# EAGLE design pqc-rev2 (EAGLE 9.0.1)
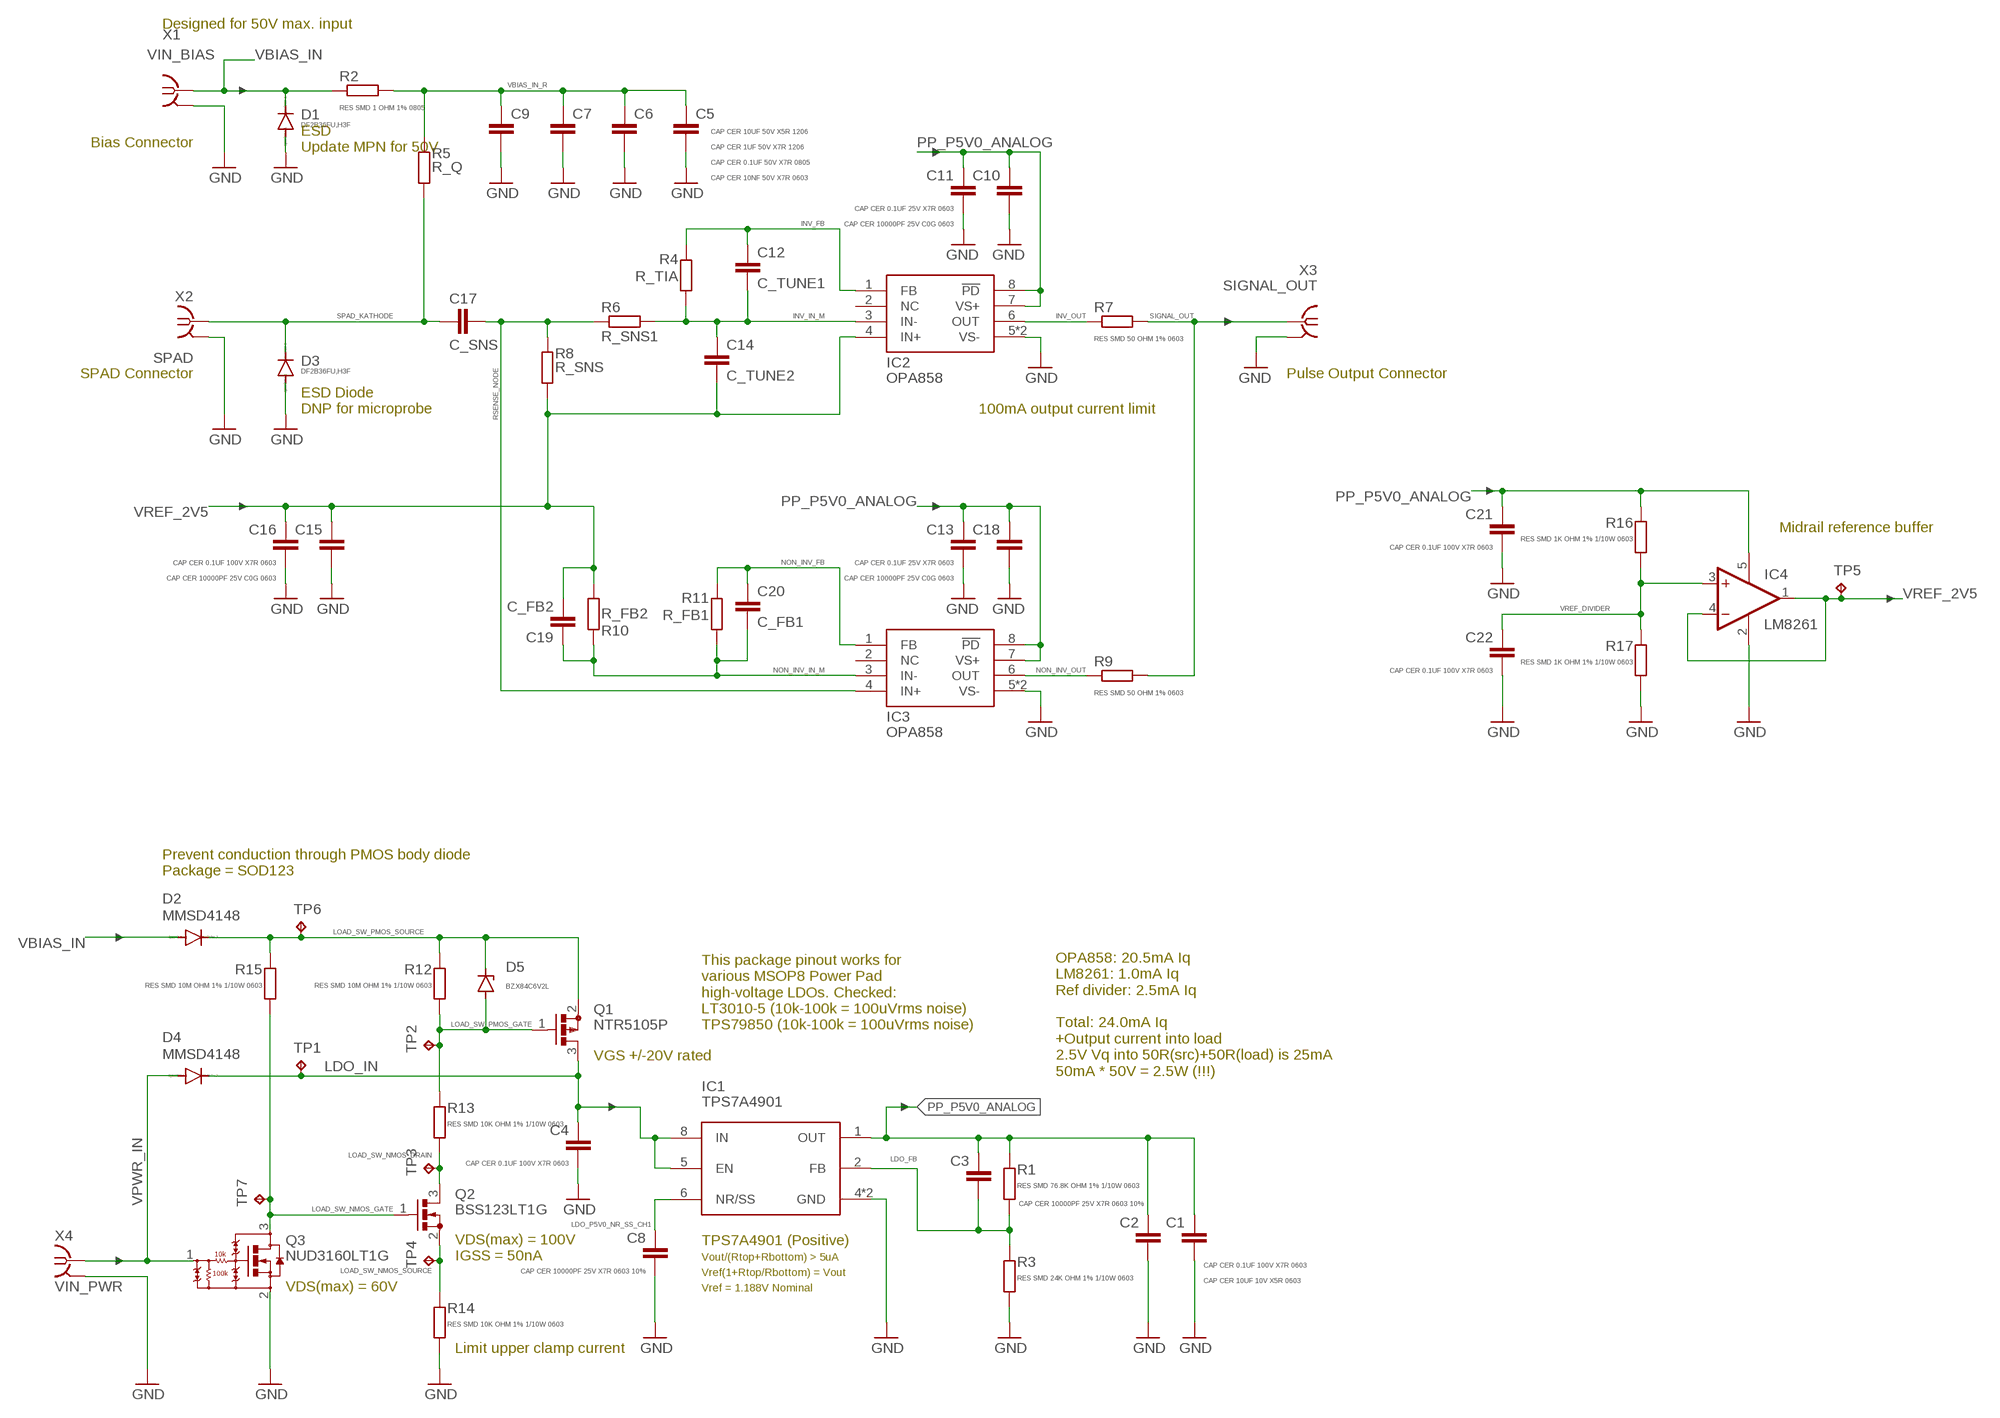
[diagram p0: schematic, sheet 1]

## Parts
C1  CAP CER 10UF 10V X5R 0603  C-EUC0603  [C0603]
C2  CAP CER 0.1UF 100V X7R 0603  C-EUC0603  [C0603]
C3  CAP CER 10000PF 25V X7R 0603 10%  C-EUC0603  [C0603]
C4  CAP CER 0.1UF 100V X7R 0603  C-EUC0603  [C0603]
C5  CAP CER 10UF 50V X5R 1206  C-EUC1206  [C1206]
C6  CAP CER 1UF 50V X7R 1206  C-EUC1206  [C1206]
C7  CAP CER 0.1UF 50V X7R 0805  C-EUC0805  [C0805]
C8  CAP CER 10000PF 25V X7R 0603 10%  C-EUC0603  [C0603]
C9  CAP CER 10NF 50V X7R 0603  C-EUC0603  [C0603]
C10  CAP CER 10000PF 25V C0G 0603  C-EUC0603  [C0603]
C11  CAP CER 0.1UF 25V X7R 0603  C-EUC0603  [C0603]
C12  C_TUNE1  C-EUC0402  [C0402]
C13  CAP CER 0.1UF 25V X7R 0603  C-EUC0603  [C0603]
C14  C_TUNE2  C-EUC0402  [C0402]
C15  CAP CER 10000PF 25V C0G 0603  C-EUC0603  [C0603]
C16  CAP CER 0.1UF 100V X7R 0603  C-EUC0603  [C0603]
C17  C_SNS  C-EUC0603  [C0603]
C18  CAP CER 10000PF 25V C0G 0603  C-EUC0603  [C0603]
C19  C_FB2  C-EUC0402  [C0402]
C20  C_FB1  C-EUC0402  [C0402]
C21  CAP CER 0.1UF 100V X7R 0603  C-EUC0603  [C0603]
C22  CAP CER 0.1UF 100V X7R 0603  C-EUC0603  [C0603]
D1  DF2B36FU,H3F  DIODE-SOD323-W  [SOD323-W]
D2  MMSD4148  DIODE-SOD123  [SOD123]
D3  DF2B36FU,H3F  DIODE-SOD323-W  [SOD323-W]
D4  MMSD4148  DIODE-SOD123  [SOD123]
D5  BZX84C6V2L  ZENER-DIODESOT23  [SOT23]
IC1  TPS7A4901  TPS7A  [MSOP-8_POWER_PAD]
IC2  OPA858  [WSON8]
IC3  OPA858  [WSON8]
IC4  LM8261  [SOT23-5]
Q1  NTR5105P  PMOS_GENERIC_SOT23-3  [SOT23C]
Q2  BSS123LT1G  NMOS_GENERIC  [SOT23C]
Q3  NUD3160LT1G  [SOT23C]
R1  RES SMD 76.8K OHM 1% 1/10W 0603  R-EU_R0603  [R0603]
R2  RES SMD 1 OHM 1% 0805  R-EU_R0805  [R0805]
R3  RES SMD 24K OHM 1% 1/10W 0603  R-EU_R0603  [R0603]
R4  R_TIA  R-EU_R0402  [R0402]
R5  R_Q  R-EU_R0805  [R0805]
R6  R_SNS1  R-EU_R0402  [R0402]
R7  RES SMD 50 OHM 1% 0603  R-EU_R0603  [R0603]
R8  R_SNS  R-EU_R0402  [R0402]
R9  RES SMD 50 OHM 1% 0603  R-EU_R0603  [R0603]
R10  R_FB2  R-EU_R0402  [R0402]
R11  R_FB1  R-EU_R0402  [R0402]
R12  RES SMD 10M OHM 1% 1/10W 0603  R-EU_R0603  [R0603]
R13  RES SMD 10K OHM 1% 1/10W 0603  R-EU_R0603  [R0603]
R14  RES SMD 10K OHM 1% 1/10W 0603  R-EU_R0603  [R0603]
R15  RES SMD 10M OHM 1% 1/10W 0603  R-EU_R0603  [R0603]
R16  RES SMD 1K OHM 1% 1/10W 0603  R-EU_R0603  [R0603]
R17  RES SMD 1K OHM 1% 1/10W 0603  R-EU_R0603  [R0603]
TP1  TPTP10R  [TP10R]
TP2  TPTP10R  [TP10R]
TP3  TPTP10R  [TP10R]
TP4  TPTP10R  [TP10R]
TP5  TPTP10R  [TP10R]
TP6  TPTP10R  [TP10R]
TP7  TPB1,27  [B1,27]
X1  VIN_BIAS  COAX  [MMCX-J-P-X-ST-EM1-MKT]
X2  SPAD  SMA-142-0701-881/886  [J502-ND-142-0701-881/886]
X3  SIGNAL_OUT  COAX  [MMCX-J-P-X-ST-EM1-MKT]
X4  VIN_PWR  COAX  [MMCX-J-P-X-ST-EM1-MKT]

## Nets
GND: C1.2 C2.2 C4.2 C5.2 C6.2 C7.2 C8.2 C9.2 C10.2 C11.2 C13.2 C15.2 C16.2 C18.2 C21.2 C22.2 D1.A D3.A IC1.4(GND) IC1.PAD(GND) IC2.5(VS-) IC2.PAD(VS-) IC3.5(VS-) IC3.PAD(VS-) IC4.2(V-) Q3.2(S) R3.2 R14.1 R17.1 X1.2@1(GND) X2.G@1(GND) X3.2@1(GND) X4.2@1(GND)
INV_FB: C12.1 IC2.1(FB) R4.1
INV_IN_M: C12.2 C14.1 IC2.3(IN-) R4.2 R6.1
INV_OUT: IC2.6(OUT) R7.2
LDO_FB: C3.2 IC1.2(FB) R1.1 R3.1
LDO_IN: C4.1 D4.C IC1.5(EN) IC1.8(IN) Q1.3(D) TP1.TP
LDO_P5V0_NR_SS_CH1: C8.1 IC1.6(NR/SS)
LOAD_SW_NMOS_DRAIN: Q2.3(D) R13.1 TP3.TP
LOAD_SW_NMOS_GATE: Q2.1(G) Q3.3(D) R15.1 TP7.TP
LOAD_SW_NMOS_SOURCE: Q2.2(S) R14.2 TP4.TP
LOAD_SW_PMOS_GATE: D5.1(A) Q1.1(G) R12.1 R13.2 TP2.TP
LOAD_SW_PMOS_SOURCE: D2.C D5.3(C) Q1.2(S) R12.2 R15.2 TP6.TP
NON_INV_FB: C20.1 IC3.1(FB) R11.1
NON_INV_IN_M: C19.1 C20.2 IC3.3(IN-) R10.1 R11.2
NON_INV_OUT: IC3.6(OUT) R9.2
PP_P5V0_ANALOG: C1.1 C2.1 C3.1 C10.1 C11.1 C13.1 C18.1 C21.1 IC1.1(OUT) IC2.7(VS+) IC2.8(!PD) IC3.7(VS+) IC3.8(!PD) IC4.5(V+) R1.2 R16.2
RSENSE_NODE: C17.2 IC3.4(IN+) R6.2 R8.2
SIGNAL_OUT: R7.1 R9.1 X3.1
SPAD_KATHODE: C17.1 D3.C R5.1 X2.1
VBIAS_IN: D1.C D2.A R2.2 X1.1
VBIAS_IN_R: C5.1 C6.1 C7.1 C9.1 R2.1 R5.2
VPWR_IN: D4.A Q3.1(G) X4.1
VREF_2V5: C14.2 C15.1 C16.1 C19.2 IC2.4(IN+) IC4.1(OUT) IC4.4(-IN) R8.1 R10.2 TP5.TP
VREF_DIVIDER: C22.1 IC4.3(+IN) R16.1 R17.2
Unconnected: IC2.2(NC) IC3.2(NC)

## Notes on the sheet
- Designed for 50V max. input
- Bias Connector
- ESD
  Update MPN for 50V
- SPAD Connector | Pulse Output Connector
- ESD Diode
  DNP for microprobe
- 100mA output current limit
- Midrail reference buffer
- Prevent conduction through PMOS body diode
  Package = SOD123
- This package pinout works for
  various MSOP8 Power Pad
  high-voltage LDOs. Checked:
  LT3010-5 (10k-100k = 100uVrms noise)
  TPS79850 (10k-100k = 100uVrms noise)
- VGS +/-20V rated
- OPA858: 20.5mA Iq
  LM8261: 1.0mA Iq
  Ref divider: 2.5mA Iq
  
  Total: 24.0mA Iq
  +Output current into load
  2.5V Vq into 50R(src)+50R(load) is 25mA
  50mA * 50V = 2.5W (!!!)
- TPS7A4901 (Positive)
- VDS(max) = 100V
  IGSS = 50nA
- Vout/(Rtop+Rbottom) > 5uA
- Vref(1+Rtop/Rbottom) = Vout
- VDS(max) = 60V | Vref = 1.188V Nominal
- Limit upper clamp current

## Power pins joined to a net without a drawn wire
GND: X1.2@2(GND) X1.2@3(GND) X1.2@4(GND) X2.G@2(GND) X2.G@3(GND) X2.G@4(GND) X3.2@2(GND) X3.2@3(GND) X3.2@4(GND) X4.2@2(GND) X4.2@3(GND) X4.2@4(GND)

## Library data of the parts
C1-C4 C8-C22 = rcl-modified-footprints:C-EU: CAPACITOR, European symbol
C5-C7 = rcl:C-EU: CAPACITOR, European symbol
D1-D4 = diode:DIODE-: DIODE
D5 = diode:ZENER-DIODE: Z-Diode
IC1 = Kramnik's Library:TPS7A*
IC2 IC3 = meng:OPA858
IC4 = meng:LM8261
Q1 = meng:PMOS_GENERIC
Q2 = meng:NMOS_GENERIC
Q3 = meng:NUD3160LT1G
R1 R3 R4 R6-R17 = rcl-modified-footprints:R-EU_: RESISTOR, European symbol
R2 R5 = rcl:R-EU_: RESISTOR, European symbol; SPICEPREFIX: R
TP1-TP7 = testpad:TP: Test pad
X1 X3 X4 = con-samtec:COAX: MMCX STRAIGHT, EDGE MOUNT JACK- 50 OHM Source: http://www.samtec.com/ftppub/cpdf/MMCX-J-P-X-ST-EM1-MKT.pdf; MF: Samtec Inc.; MPN: MMCX-J-P-X-ST-EM1-MKT; OC_FARNELL: unknown; OC_NEWARK: unknown
X2 = meng:SMA-: SMA 50 Ohm End Launch Jack Receptacle - Round Contact Johnson Components Source: www.johnsoncomponents.com .. J502-ND.pdf; MF: JOHNSON COMPONENTS; MPN: 142-0701-881; OC_FARNELL: 1608603; OC_NEWARK: 08B906

## Net classes
1 100OHM_DIFF: width 0.254 mm, clearance 0.254 mm

## Board
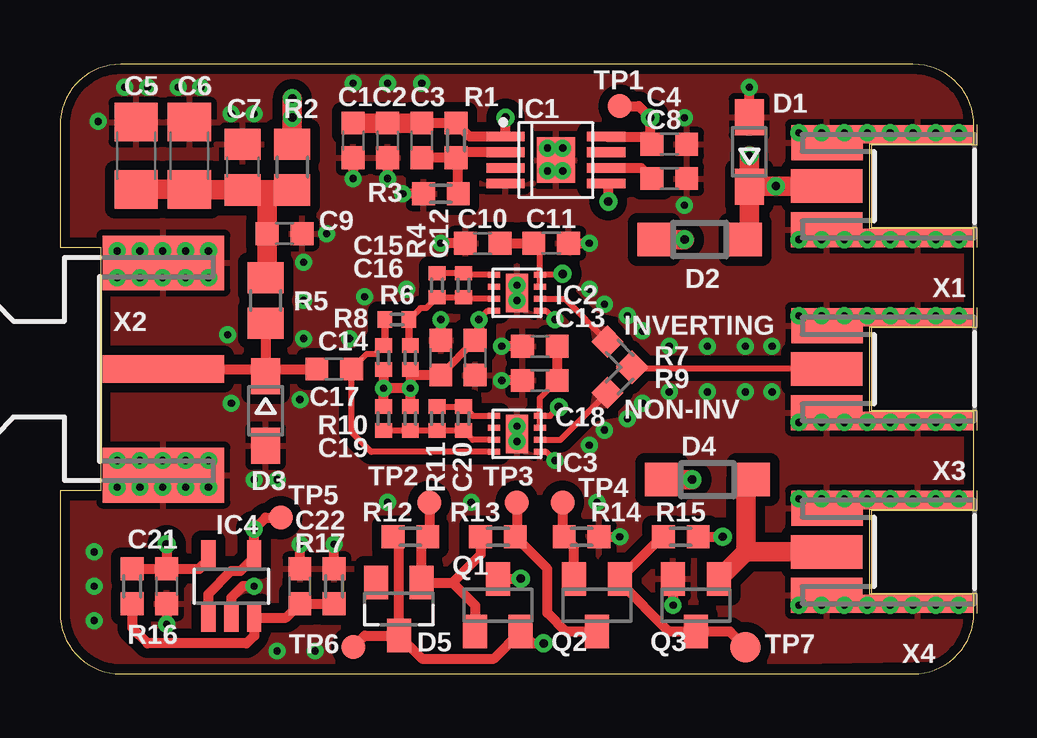
[diagram p1: board, top side]
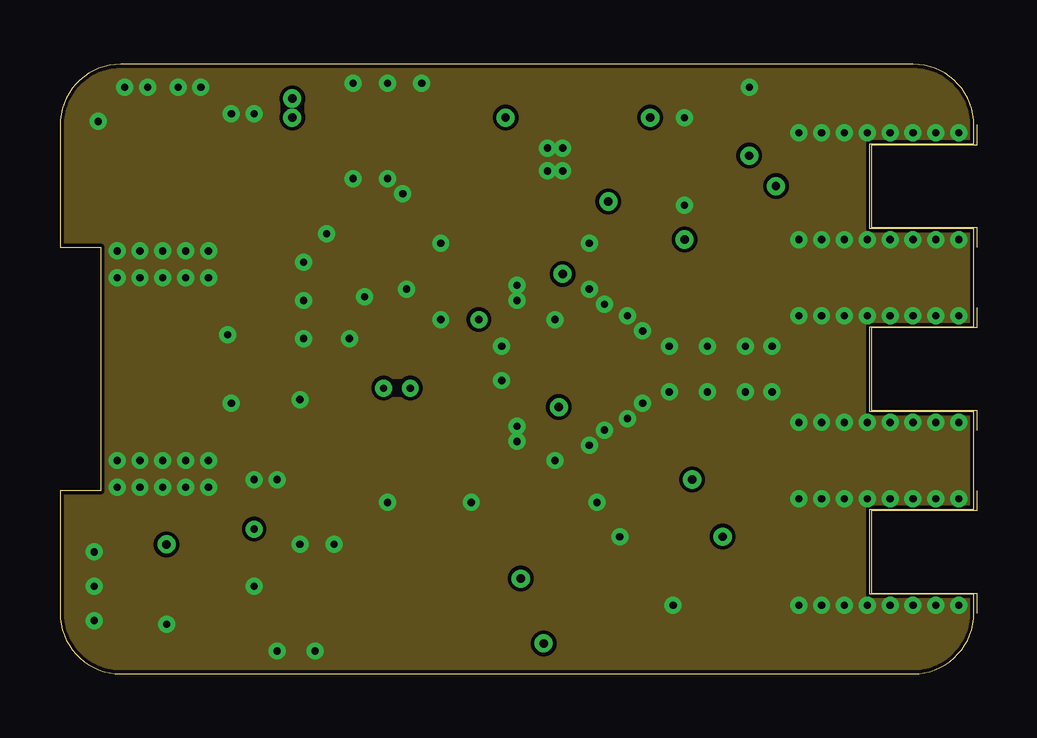
[diagram p2: board, inner layer Route2]
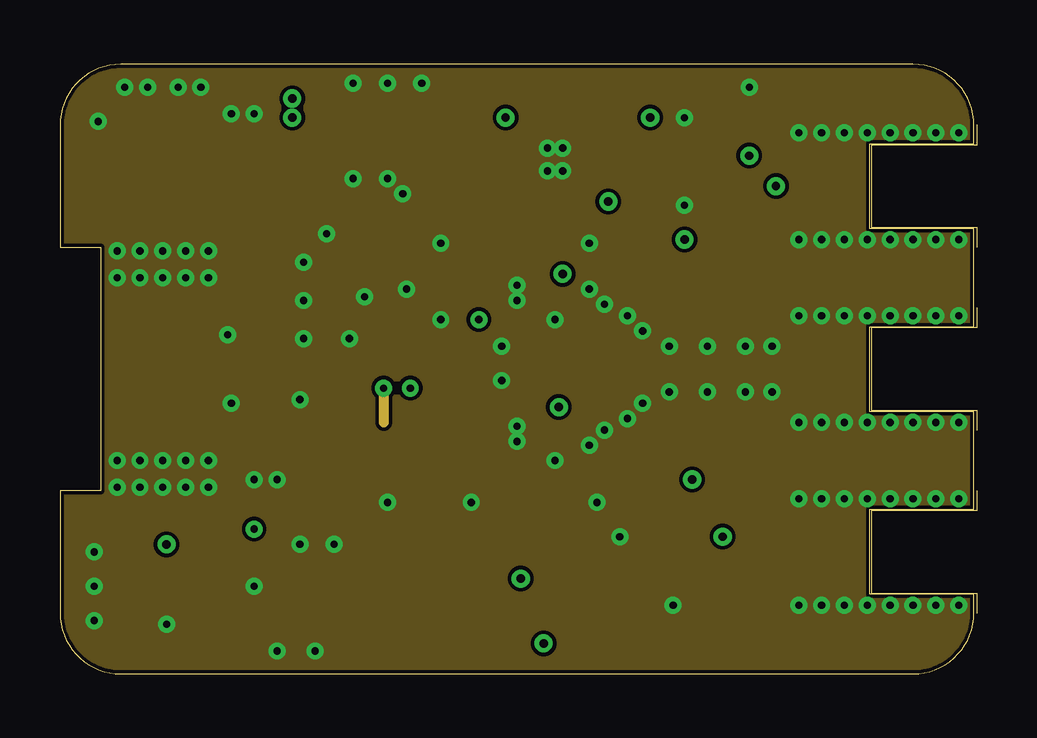
[diagram p3: board, inner layer Route15]
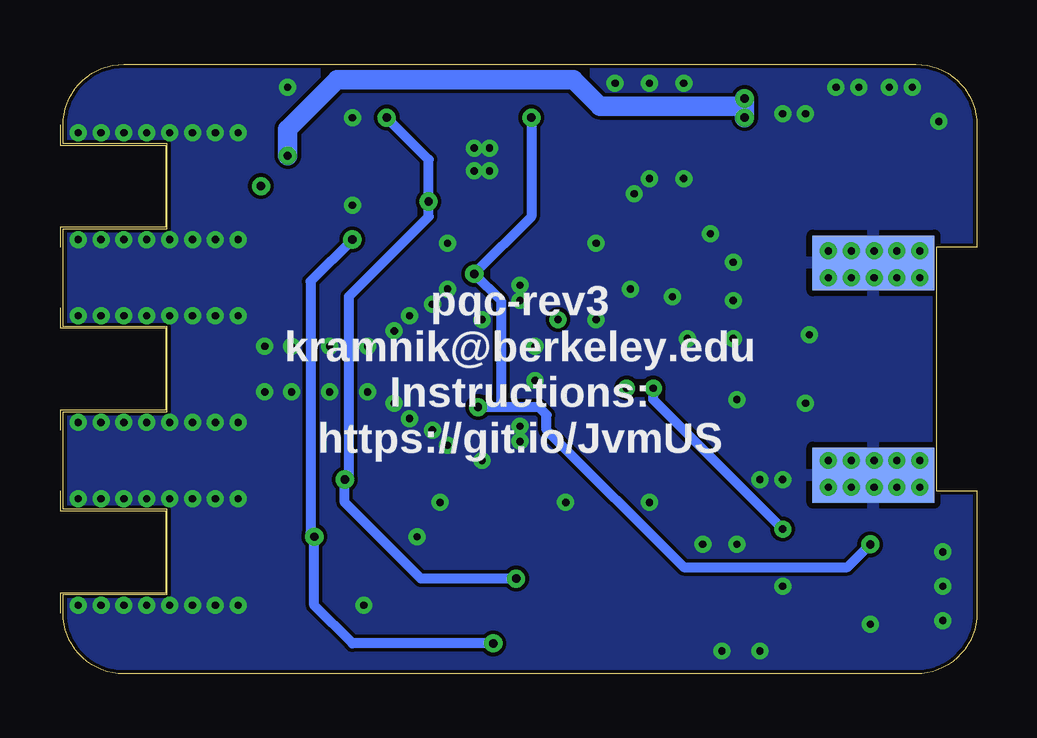
[diagram p4: board, bottom side, seen from below]

Size 38.1 x 25.4 mm. Coordinates in mm from the lower left corner, seen from the top.
Outline: 0,7.62 0,2.54 arc90 2.54,0 35.56,0 arc90 38.1,2.54 38.1,3.31 33.76,3.31 33.76,6.85 38.1,6.85 38.1,10.93 33.76,10.93 33.76,14.47 38.1,14.47 38.1,18.55 33.76,18.55 33.76,22.09 38.1,22.09 38.1,22.86 arc90 35.56,25.4 2.54,25.4 arc90 0,22.86 0,17.78 1.7,17.78 1.7,7.62 0,7.62
Copper layers (1+2*15+16): Top 0.035mm / dielectric 1.5mm / Route2 0.035mm / dielectric 0.15mm / Route15 0.035mm / dielectric 0.2mm / Bottom 0.035mm
Design rules "default *": minimum track width 6mil, minimum drill 0.3mm, track to track 6mil, track to pad 6mil, pad to pad 6mil, via to via 6mil, smd to smd 0mil, copper to edge 6mil, drill to drill 6mil, minimum pad ring 10mil, minimum via ring 8mil, stop-mask expansion 2mil, vias tented up to drill 0.35mm, thermal gap 10mil

### Footprints (pad centres in the part's own frame; a part is rotated, then mirrored left to right if it is on the bottom)
C0603 = smd 0.95 x 0.95: 1 -0.725,0; 2 0.725,0
C1206 = smd 1.6 x 1.8: 1 -1.4,0; 2 1.4,0
C0805 = smd 1.3 x 1.5: 1 -0.95,0; 2 0.95,0
C0402 = smd 0.6 x 0.7: 1 -0.5,0; 2 0.5,0
SOD323-W = smd 1.5 x 1.2: A 1.45,0; C -1.45,0
SOD123 = smd 1.4 x 1.4: A 1.9,0; C -1.9,0
SOT23 = smd 1 x 1.4: 1 -0.95,-1.1; 2 0.95,-1.1; 3 0,1.1
MSOP-8_POWER_PAD = smd 0.4 x 1.6: 1 0,0; 2 0.65,0; 3 1.3,0; 4 1.95,0; 5 1.95,4.2; 6 1.3,4.2; 7 0.65,4.2; 8 0,4.2 | smd 1.89 x 1.57: PAD 0.975,2.1
WSON8 = smd 0.5 x 0.25: 1 -0.95,0.75; 2 -0.95,0.25; 3 -0.95,-0.25; 4 -0.95,-0.75; 5 0.95,-0.75; 6 0.95,-0.25; 7 0.95,0.25; 8 0.95,0.75 | smd 0.9 x 1.6: PAD 0,0
SOT23-5 = smd 0.6 x 1.2: 1 -0.95,-1.306; 2 0,-1.306; 3 0.95,-1.306; 4 0.95,1.306; 5 -0.95,1.306
SOT23C = smd 1 x 1.4: 1 -0.95,-1.1; 2 0.95,-1.1; 3 0,1.1
R0603 = smd 0.95 x 0.95: 1 -0.725,0; 2 0.725,0
R0805 = smd 1.3 x 1.5: 1 -0.95,0; 2 0.95,0
R0402 = smd 0.6 x 0.7: 1 -0.5,0; 2 0.5,0
TP10R = smd 1 x 1: TP 0,0
B1,27 = smd 1.27 x 1.27: TP 0,0
MMCX-J-P-X-ST-EM1-MKT = smd 1.4 x 2.975: 1 0,-6.15 | smd 1.46 x 2.975: 2@1 -1.812,-6.125; 2@2 1.812,-6.138 | smd 0.76 x 4.7: 2@3 -2.163,-2.35; 2@4 2.163,-2.35
J502-ND-142-0701-881/886 = smd 5.08 x 1.143: 1 2.565,0 | smd 5.08 x 2.286: G@1 2.565,4.42; G@2 2.565,-4.42 | smd 5.08 x 2.286 bottom: G@3 2.565,4.42; G@4 2.565,-4.42

### Placement (x,y rotation side)
C1  12.22,22.23 270 top
C2  13.65,22.23 270 top
C3  15.08,22.23 270 top
C4  25.4,22.07 0 top
C5  3.17,21.59 90 top
C6  5.4,21.59 90 top
C7  7.62,21.11 90 top
C8  25.4,20.64 0 top
C9  9.37,18.34 0 top
C10  17.62,17.94 180 top
C11  20.48,17.94 0 top
C12  16.83,16.19 270 top
C13  20,13.65 180 top
C14  14.61,13.18 270 top
C15  15.88,13.18 90 top
C16  17.3,13.18 270 top
C17  11.43,12.7 0 top
C18  20,12.22 180 top
C19  14.61,10.64 90 top
C20  16.83,10.64 270 top
C21  4.45,3.65 270 top
C22  10,3.65 90 top
D1  28.73,21.75 90 top
D2  26.67,18.1 0 top
D3  8.57,10.95 270 top
D4  26.99,8.1 0 top
D5  14.13,2.7 180 top
IC1  18.57,22.38 270 top
IC2  19.05,15.88 0 top
IC3  19.05,10 0 top
IC4  7.14,3.65 0 top
Q1  18.26,2.86 0 top
Q2  22.38,2.86 180 top
Q3  26.51,2.86 180 top
R1  16.51,22.23 90 top
R2  9.68,21.11 90 top
R3  15.88,20 180 top
R4  15.72,16.19 270 top
R5  8.57,15.56 90 top
R6  14.05,14.76 180 top
R7  23.34,13.34 135 top
R8  13.49,13.18 90 top
R9  23.34,12.22 225 top
R10  13.49,10.64 90 top
R11  15.72,10.64 270 top
R12  14.61,5.71 180 top
R13  18.26,5.71 180 top
R14  21.75,5.71 180 top
R15  25.88,5.71 0 top
R16  3.02,3.65 90 top
R17  11.43,3.65 270 top
TP1  23.34,23.65 0 top
TP2  15.4,7.14 0 top
TP3  19.05,7.14 0 top
TP4  20.95,7.14 0 top
TP5  9.21,6.51 0 top
TP6  12.22,1.11 0 top
TP7  28.57,1.11 0 top
X1  38.1,20.32 270 top
X2  1.75,12.7 0 top
X3  38.1,12.7 270 top
X4  38.1,5.08 270 top

### Tracks (layer width: path | path; a pad name or v marks a point on that pad's centre or on a via)
GND  (via drill 0.3)
  Top 0.254: IC2.5 20.28,15.12 v20.64,14.76 | IC3.5 20.28,9.25 v20.64,8.89
  Top 0.406: C18.2 v18.41,12.22 | C13.2 v18.41,13.65 | C11.2 v22.07,17.94 | C10.2 v15.88,17.94 | D3.A 8.89,9.19 | v8.1,3.65 7.62,3.65 7.14,3.17 IC4.2 | Q3.2 v25.56,2.86 | C15.2 v15.88,14.76 | D1.A v28.73,24.45 | R3.2 v14.29,20 | X1.2@2 32.37,18.1 v32.7,18.1 | X1.2@1 31.75,22.36 v31.75,22.54 | R14.1 v23.34,5.71 | R17.1 v11.43,5.4 | C21.2 v4.45,2.06 | C22.2 v10,5.4 | C1.2 v12.22,20.64 | C2.2 v13.65,20.64
  other vias: 8.1,8.1 4.92,24.45 5.87,24.45 8.1,23.34 7.14,23.34 9.05,8.1 3.65,24.45 2.7,24.45 19.05,16.19 19.05,15.56 19.05,10.32 19.05,9.68 20.32,21.91 20.95,21.91 20.95,20.95 20.32,20.95 26.04,19.53 26.04,23.18 37.47,22.54 36.51,22.54 35.56,22.54 34.61,22.54 33.66,22.54 32.7,22.54 30.8,22.54 30.8,18.1 31.75,18.1 33.66,18.1 34.61,18.1 35.56,18.1 36.51,18.1 37.47,18.1 4.29,8.89 4.29,16.51 5.24,8.89 6.19,8.89 3.33,8.89 2.38,8.89 5.24,16.51 6.19,16.51 3.33,16.51 2.38,16.51 37.47,14.92 36.51,14.92 35.56,14.92 34.61,14.92 33.66,14.92 32.7,14.92 31.75,14.92 30.8,14.92 37.47,2.86 36.51,2.86 35.56,2.86 34.61,2.86 33.66,2.86 32.7,2.86 31.75,2.86 30.8,2.86 37.47,7.3 36.51,7.3 35.56,7.3 34.61,7.3 33.66,7.3 32.7,7.3 31.75,7.3 30.8,7.3 37.47,10.48 36.51,10.48 35.56,10.48 34.61,10.48 33.66,10.48 32.7,10.48 31.75,10.48 30.8,10.48 10.64,0.95 9.05,0.95 12.22,24.61 13.65,24.61 15.08,24.61 29.69,13.65 26.99,13.65 26.99,11.75 28.57,13.65 28.57,11.75 29.69,11.75 25.4,11.75 25.4,13.65 24.29,14.29 24.29,11.27 22.7,10.16 22.7,15.4 22.07,16.03 22.07,9.53 23.65,10.64 23.65,14.92 2.38,7.78 3.33,7.78 4.29,7.78 5.24,7.78 6.19,7.78 2.38,17.62 3.33,17.62 4.29,17.62 5.24,17.62 6.19,17.62 6.99,14.13 7.14,11.27 10,11.43 10.16,13.97 12.06,13.97 14.45,16.03 12.7,15.72 1.59,23.02 11.11,18.34 10.16,15.56 10.16,17.14 17.14,7.14 13.65,7.14 22.38,7.14 1.43,3.65 1.43,2.22 1.43,5.08
  pour Bottom: -1,38.1 80.68,38.1 81,-1 -1,-1
  pour Route2 (rank 6): -2,39.3 82,39.3 82,-2 -2,-2
  pour Top (isolate 0.406, rank 2): 0,25.4 38.1,26.04 38.1,0.64 0,0
  pour Route15: -2.06,27.94 42.7,27.94 42.7,-6.19 -2.06,-6.19
INV_FB
  Top 0.254: IC2.1 16.89,16.62 C12.1 R4.1
INV_IN_M
  Top 0.254: IC2.3 16.89,15.62 C12.2 R4.2 15.26,15.24 15.03,15.24 R6.1
  Top 0.305: C14.1 arc-45 14.55,13.81 R6.1
INV_OUT
  Top 0.254: IC2.6 21.05,15.62 R7.2
  pour Top (no thermals): 22.07,14.61 22.23,13.81 22.86,14.45
LDO_FB
  Top 0.406: IC1.2 16.74,21.73 R1.1 | R1.1 C3.2 | R3.1 16.6,21.41 R1.1
LDO_IN  (via drill 0.35)
  Top 0.406: IC1.8 24.36,22.38 C4.1 24.61,22.14 v24.61,23.18 24.13,23.65 TP1.TP | Q1.3 19.2,3.96 v19.21,3.97 | v22.86,19.68 22.86,20.35 IC1.5
  Top 0.813: D4.C v26.35,8.1
  Bottom 0.406: v19.21,3.97 23.18,3.97 26.35,7.14 v26.35,8.1 26.19,8.26 26.19,15.72 22.86,19.05 v22.86,19.68 22.86,21.43 v24.61,23.18
LDO_P5V0_NR_SS_CH1
  Top 0.406: IC1.6 24.23,21.08 C8.1
LOAD_SW_NMOS_DRAIN
  Top 0.406: Q2.3 21.1,1.76 20.32,2.54 20.32,4.38 R13.1 19.05,5.78 TP3.TP
LOAD_SW_NMOS_GATE
  Top 0.406: R15.1 25.09,5.71 Q2.1 23.33,3.81 25.39,1.76 Q3.3 27.93,1.76 TP7.TP
LOAD_SW_NMOS_SOURCE
  Top 0.406: Q2.2 21.43,5.3 R14.2 20.95,5.78 TP4.TP
LOAD_SW_PMOS_GATE
  Top 0.406: 16.36,3.8 D5.1 15.08,5.46 R12.1 15.4,5.78 TP2.TP | Q1.1 17.31,2.85 16.36,3.8 | R13.2 17.53,4.97 16.36,3.8
LOAD_SW_PMOS_SOURCE  (via drill 0.35)
  Top 0.406: D5.3 14.13,5.47 R12.2 | D5.3 15.09,0.64 18.08,0.64 Q1.2 19.69,1.27 v20.16,1.27 | R15.2 v27.62,5.71 | TP6.TP 12.71,1.59 D5.3
  Top 0.813: D2.C v26.04,18.1
  Bottom 0.406: v20.16,1.27 26.04,1.27 27.62,2.86 v27.62,5.71 27.78,5.87 27.78,16.35 v26.04,18.1
NON_INV_FB
  Top 0.254: R11.1 C20.1 17.21,10.75 IC3.1
NON_INV_IN_M
  Top 0.254: IC3.3 17.21,9.75 C20.2 R11.2 C19.1 R10.1
NON_INV_OUT
  Top 0.254: IC3.6 20.86,9.75 R9.2
  pour Top (no thermals): 22.07,10.95 22.86,11.11 22.23,11.75
PP_P5V0_ANALOG  (via drill 0.35)
  Top 0.254: IC2.7 IC2.8 | IC3.7 IC3.8 | IC3.8 20,11.5 C18.1 | v20.95,16.67 20.91,16.62 IC2.8 | IC2.8 20,17.69 C11.1 | IC3.8 20.43,10.75 v20.8,11.11
  Top 0.406: C13.1 C18.1 | C3.1 R1.2 17.08,22.38 IC1.1 v18.57,23.18 | C21.1 5.8,4.38 6.19,4.76 IC4.5 | C10.1 C11.1 19.84,17.85 | R16.2 C21.1 | v4.45,5.4 C21.1
  Top 0.813: C1.1 C2.1 C3.1
  Bottom 0.406: 19.84,11.11 18.26,11.11 17.94,10.79 17.94,10.16 12.22,4.45 5.4,4.45 v4.45,5.4 | 19.84,11.11 v20.8,11.11 | 19.84,11.11 19.84,15.56 v20.95,16.67 18.57,19.05 v18.57,23.18
RSENSE_NODE
  Top 0.254: IC3.4 12.97,9.25 12.15,10.07 C17.2 12.79,13.34 13.15,13.34 R8.2
  Top 0.305: R8.2 arc45 13.55,13.81 R6.2
SIGNAL_OUT
  Top 0.254: R7.1 23.97,12.7 | 23.97,12.7 | R9.1 31.91,12.74 X3.1
  Top 0.406: R9.1 R7.1
SPAD_KATHODE
  Top 0.406: X2.1 8.57,12.7 | 8.57,12.7 C17.1 | R5.1 8.57,12.7 | D3.C 8.57,12.7
VBIAS_IN  (via drill 0.35)
  Top 0.813: D1.C | D1.C 28.73,18.26 D2.A | R2.2 v9.68,23.18 v9.68,23.97 | D1.C v28.73,21.59 | X1.1 v29.84,20.32 28.75,20.32 D1.C
  Bottom 0.813: v28.73,21.59 28.73,22.7 26.67,24.77 16.83,24.77 15.72,23.65 9.68,23.65 | v9.68,23.97 9.68,23.65 | 9.68,23.65 v9.68,23.18
VBIAS_IN_R
  Top 0.406: 7.59,20.19 C7.1
  Top 0.813: C5.1 C6.1 5.42,20.16 C7.1 8.64,20.16 | R2.1 8.64,20.16 | 8.64,20.16 C9.1 8.64,16.51 R5.2
VPWR_IN
  Top 0.813: Q3.1 28.58,5.08 | 28.58,5.08 X4.1 | 28.58,5.08 28.58,8.1 D4.A
VREF_2V5  (via drill 0.3)
  Top 0.254: IC2.4 17.82,15.12 v17.46,14.76
  Top 0.305: C15.1 15.88,12.47 C16.1
  Top 0.406: R10.2 v13.49,11.91 | C19.2 v14.61,11.91 | IC4.4 8.09,4.86 7.52,4.29 7.14,4.29 6.19,3.34 IC4.1 | R8.1 v13.49,11.91 | C14.2 14.61,12.45 | 14.61,12.45 v14.61,11.91 | v14.61,11.91 v13.49,11.91 | C15.1 14.61,12.45 | v17.46,14.76 17.46,14.06 C16.1 | IC4.4 | IC4.4 v8.1,6.03 8.57,6.51 TP5.TP
  Route15 0.406: v13.49,11.91 13.49,10.48
  Bottom 0.406: v8.1,6.03 13.49,11.43 v13.49,11.91
VREF_DIVIDER
  Top 0.406: R16.1 3.02,1.91 3.65,1.27 7.78,1.27 8.09,1.58 IC4.3 9.42,2.35 C22.1 R17.2

### Text on the board
tPlace: INVERTING | NON-INV
bPlace: pqc-rev3 / kramnik@berkeley.edu / Instructions: / https://git.io/JvmUS